# Altium schematic sheet Sheet1.SchDoc
size A4; SheetNumber: 1; SheetTotal: 1
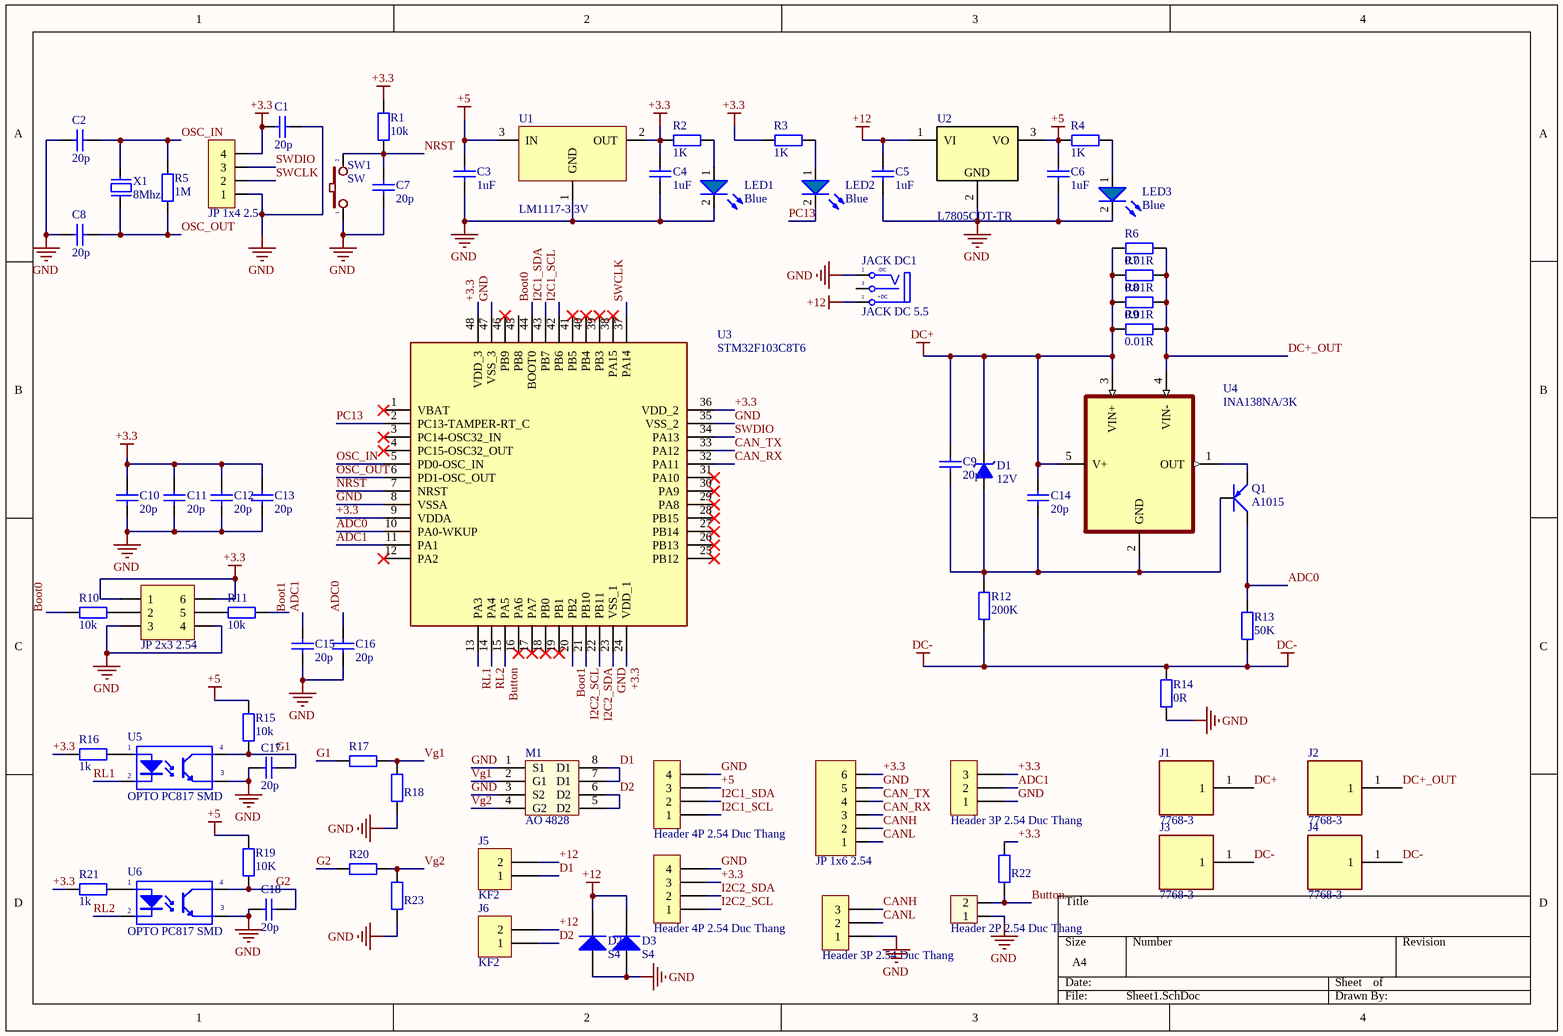
[diagram p0: Sheet1.SchDoc]

## Parts
C1  20p  [tu 0805]
C2  20p  [tu 0805]
C3  1uF  [tu 0805]
C4  1uF  [tu 0805]
C5  1uF  [tu 0805]
C6  1uF  [tu 0805]
C7  20p  [tu 0805]
C8  20p  [tu 0805]
C9  20p  [tu 0805]
C10  20p  [tu 0805]
C11  20p  [tu 0805]
C12  20p  [tu 0805]
C13  20p  [tu 0805]
C14  20p  [tu 0805]
C15  20p  [tu 0805]
C16  20p  [tu 0805]
C17  20p  [tu 0805]
C18  20p  [tu 0805]
D1  12V  [DIODE ZENNER SMD SOD80]
D2  S4  [DIODE SOD-123]
D3  S4  [DIODE SOD-123]
H1  Header 4P 2.54 Duc Thang  [XH2.54M-4]
H2  Header 3P 2.54 Duc Thang  [XH2.54M-3]
H3  Header 4P 2.54 Duc Thang  [XH2.54M-4]
H4  Header 3P 2.54 Duc Thang  [XH2.54M-3]
H5  Header 2P 2.54 Duc Thang  [XH2.54M-2]
J1  7768-3  [KEYSTONE_7768-3]
J2  7768-3  [KEYSTONE_7768-3]
J3  7768-3  [KEYSTONE_7768-3]
J4  7768-3  [KEYSTONE_7768-3]
J5  KF2  [KF2-5.08]
J6  KF2  [KF2-5.08]
JACK_DC1  JACK DC 5.5  [JACK DC 5.5]
JP1  JP 1x4 2.54  [JP 1x4 DT]
JP2  JP 2x3 2.54  [JP 2x3 DT]
JP3  JP 1x6 2.54  [JP 1x6 CT]
LED1  value Blue  [LED-0805-Blue]  (hidden comment: LED-Blue)
LED2  value Blue  [LED-0805-Blue]  (hidden comment: LED-Blue)
LED3  value Blue  [LED-0805-Blue]  (hidden comment: LED-Blue)
M1  AO 4828  [SOp 8]
Q1  A1015  [TO92]
R1  10k  [tro smd 0805]
R2  1K  [tro smd 0805]
R3  1K  [tro smd 0805]
R4  1K  [tro smd 0805]
R5  1M  [tro smd 0805]
R6  0.01R  [tro smd 2512]
R7  0.01R  [tro smd 2512]
R8  0.01R  [tro smd 2512]
R9  0.01R  [tro smd 2512]
R10  10k  [tro smd 0805]
R11  10k  [tro smd 0805]
R12  200K  [tro vach 1/4w]
R13  50K  [tro smd 0805]
R14  0R  [tro smd 0805]
R15  10k  [tro smd 0805]
R16  1k  [tro smd 0805]
R17  1k  [tro smd 0805]  (value not drawn)
R18  10k  [tro smd 0805]  (value not drawn)
R19  10K  [tro smd 0805]
R20  1k  [tro smd 0805]  (value not drawn)
R21  1k  [tro smd 0805]
R22  10k  [tro smd 0805]  (value not drawn)
R23  10k  [tro smd 0805]  (value not drawn)
SW1  SW  [SW1-SMD]
U1  LM1117-3.3V  [SOT223]
U2  L7805CDT-TR  [DPAK_118_446_112X59_SMD]
U3  STM32F103C8T6  [LQFP-48_19.6_393_58X11_SMD]
U4  INA138NA/3K  [SOT95P280X145-5N]
U5  OPTO PC817 SMD  [SOP4]
U6  OPTO PC817 SMD  [SOP4]
X1  8Mhz  [XT2]

## Nets
+3.3: C1.1 C4.1 C10.1 C11.1 C12.1 C13.1 H2.3 H3.3 JP1.4 JP2.1 JP2.6 JP3.6 R1.2 R2.2 R3.2 R16.1 R21.1 R22.2 U1.2(OUT) U3.9(VDDA) U3.24(VDD_1) U3.36(VDD_2) U3.48(VDD_3)
+5: C3.1 C6.1 H1.3 R4.2 R15.1 R19.1 U1.3(IN) U2.3(VO)
+12: C5.1 D2.2(K) D3.2(K) J5.2 J6.2 JACK_DC1.1(T) U2.1(VI)
DC+: C9.1 C14.1 D1.2(K) J1.1 R6.1 R7.1 R8.1 R9.1 U4.3(VIN+) U4.5(V+)
DC-: J3.1 J4.1 R12.1 R13.1 R14.2
GND: C1.2 C2.2 C3.2 C4.2 C5.2 C6.2 C7.2 C8.2 C10.2 C11.2 C12.2 C13.2 C15.2 C16.1 C17.1 C18.1 D2.1(A) D3.1(A) H1.4 H2.1 H3.4 H4.1 H5.1 JACK_DC1.2(TN) JP1.1 JP2.3 JP2.4 JP3.5 LED1.2(K) LED3.2(K) M1.1(S1) M1.3(S2) R14.1 R18.1 R23.1 SW1.1 U1.1(GND) U2.2 U3.8(VSSA) U3.23(VSS_1) U3.35(VSS_2) U3.47(VSS_3) U5.3(E) U6.3(E)
ADC0: C16.2 Q1.2(C) R13.2 U3.10(PA0-WKUP)
ADC1: C15.1 H2.2 U3.11(PA1)
Boot0: R10.1 U3.44(BOOT0)
Boot1: R11.2 U3.20(PB2)
Button: H5.2 R22.1 U3.15(PA5)
CAN_RX: JP3.3 U3.32(PA11)
CAN_TX: JP3.4 U3.33(PA12)
CANH: H4.3 JP3.2
CANL: H4.2 JP3.1
D1: J5.1 M1.7(D1) M1.8(D1)
D2: J6.1 M1.5(D2) M1.6(D2)
DC+_OUT: J2.1 R6.2 R7.2 R8.2 R9.2 U4.4(VIN-)
G1: C17.2 R15.2 R17.1 U5.4(C)
G2: C18.2 R19.2 R20.1 U6.4(C)
I2C1_SCL: H1.1 U3.42(PB6)
I2C1_SDA: H1.2 U3.43(PB7)
I2C2_SCL: H3.1 U3.21(PB10)
I2C2_SDA: H3.2 U3.22(PB11)
NRST: C7.1 R1.1 SW1.2 U3.7(NRST)
OSC_IN: C2.1 R5.1 U3.5(PD0-OSC_IN) X1.2
OSC_OUT: C8.1 R5.2 U3.6(PD1-OSC_OUT) X1.1
PC13: LED2.2(K) U3.2(PC13-TAMPER-RT_C)
RL1: U3.13(PA3) U5.2(K)
RL2: U3.14(PA4) U6.2(K)
SWCLK: JP1.2 U3.37(PA14)
SWDIO: JP1.3 U3.34(PA13)
Vg1: M1.2(G1) R17.2 R18.2
Vg2: M1.4(G2) R20.2 R23.2
NetC9_2: C9.2 C14.2 D1.1(A) Q1.3(B) R12.2 U4.2(GND)
NetJP2_2: JP2.2 R10.2
NetJP2_5: JP2.5 R11.1
NetLED1_1: LED1.1(A) R2.1
NetLED2_1: LED2.1(A) R3.1
NetLED3_1: LED3.1(A) R4.1
NetQ1_1: Q1.1(E) U4.1(OUT)
NetR16_2: R16.2 U5.1(A)
NetR21_2: R21.2 U6.1(A)

Not connected (* = marked no-connect by the designer): JACK_DC1 3(S); U3 1(VBAT)* 3(PC14-OSC32_IN)* 4(PC15-OSC32_OUT)* 12(PA2)* 16(PA6)* 17(PA7)* 18(PB0)* 19(PB1)* 25(PB12)* 26(PB13)* 27(PB14)* 28(PB15)* 29(PA8)* 30(PA9)* 31(PA10)* 38(PA15)* 39(PB3)* 40(PB4)* 41(PB5)* 45(PB8) 46(PB9)*

## Notes on the sheet
- (in symbol JACK DC 5.5) -DC; +DC
- (in symbol REG_35V_5V-1.5A-7.5W-DPAK) GND

## Library data of the parts
C1-C18 = Tu 0805 474 50V 10%: Dán; Don_Vi: Con; So_Chan: 2; Ten_Linh_Kien: Tụ 0805 474-470nF 50V 10%; Ma_Hang: MH006116; Chung_Loai: Dán; Kieu_Chan: *
D1 = Diode Zener 12V: Dán; Ma_Hang: MH000945; Don_Vi: Con; Ten_Linh_Kien: Diode Zener 1/2W 12V SMD1206 ZMM12; Kieu_Chan: *; Ghi_Chu: *; Chung_Loai: Dán
D2 D3 = Diode S4: Dán; Ten_Linh_Kien: Diode S4 SOD123 ( 1N5819 SOD123); Ma_Hang: MH005519; Don_Vi: Con; Ghi_Chu: *; Chung_Loai: Dán; Kieu_Chan: *
H1 H3 = Header 4P 2.54 Duc Thang: Cắm; Ten_Linh_Kien: Header 4P XH2.54-4P Đực Thẳng; Don_Vi: Con; Ma_Hang: MH001285; Chung_Loai: Cắm
H2 H4 = Header 3P 2.54 Duc Thang: Cắm; Ten_Linh_Kien: Header 3P XH2.54-3P Đực Thẳng; Don_Vi: Con; Ma_Hang: MH001292; Chung_Loai: Cắm
H5 = Header 2P 2.54 Duc Thang: Cắm; Ten_Linh_Kien: Header 2P XH2.54-2P Đực Thẳng; Don_Vi: Con; Ma_Hang: MH001283; Chung_Loai: Cắm
J5 J6 = KF2: Manufacturer: Würth Elektronik eiSos GmbH; partNo: 691103110002; ComponentLink1 Description: Manufacturer; ComponentLink2 Description: Datasheet; NoPins: 2; Created Date: 29 October 2013; ComponentLink1URL: http://www.we-online.com; ComponentLink2URL: http://katalog.we-online.de/em/datasheet/6911031100xx.pdf; Created by: Karrer Zheng
JACK_DC1 = JACK DC 5.5: Value: Jac DC
JP1 = JP 1x4 2.54 Duc Thang: Cắm; Ten_Linh_Kien: Jump Đơn Đực 2.54MM 1x40P Thẳng 11MM; Don_Vi: Con; Ma_Hang: MH000903; Ghi_Chu: *; Kieu_Chan: *; Chung_Loai: Cắm
JP2 = JP 2x3 2.54 Duc Thang: Cắm; Ten_Linh_Kien: Jump Đôi Đực 2.54MM 2x40P Thẳng 11MM; Don_Vi: Con; Ma_Hang: MH002686; Ghi_Chu: *; Kieu_Chan: *; Chung_Loai: Cắm
JP3 = JP 1x6 2.54 Cai Thang: Cắm; Ten_Linh_Kien: Jump Đơn Cái 2.54MM 1x20P Thẳng; Don_Vi: Con; Ma_Hang: MH004006; Ghi_Chu: *; Kieu_Chan: *; Chung_Loai: Cắm
LED1-LED3 = LED-Blue: LED Blue 10mA 2.2v; ComponentLink1Description: Datasheet; ComponentLink1URL: D:\Dropbox\Datasheets\Opto and Illumination\LEDs\SMD LED.pdf; Unit Price: 0.0476
M1 = APM 4828 SMD: Dán; Ten_Linh_Kien: AO4828 SOP8 MOSFET N-2CH 4.5A 60V; Ma_Hang: MH005678; Don_Vi: Con; Kieu_Chan: *; Ghi_Chu: *; Chung_Loai: Dán
Q1 = A1015: PNP 600mW, ECB; Value: A1015
R1-R5 R10 R11 R13-R23 = Tro 0805 1% 33k: Dán; Don_Vi: Con; So_Chan: 2; Ten_Linh_Kien: Trở 0805 1% 33k; Ma_Hang: MH005478; Chung_Loai: Dán; Kieu_Chan: *
R6-R9 = Tro 2512 1% 0.01R: Dán; Don_Vi: Con; So_Chan: 2; Ten_Linh_Kien: Trở 2512 1% R010-0.01R 1W; Ma_Hang: MH004912; Chung_Loai: Dán; Kieu_Chan: *
R12 = Tro Vach 1/4W 5% 1.2M: Cắm; Don_Vi: Con; So_Chan: 2; Ten_Linh_Kien: Trở Vạch 1/4w 5% 1.2M; Ma_Hang: MH007349; Chung_Loai: Cắm; Kieu_Chan: *
SW1 = SW2: Switch button 2 pin; Value: SW chip 2 pin
U1 = LM1117: 800mA Low-Dropout Linear Regulator; Creator: Nguyen Ba Bien; Website: http://group3i.net
U2 = REG_35V_5V-1.5A-7.5W-DPAK: Linear Voltage Regulator IC 1 Output 1.5A DPAK; Manufacturer: Diodes; Alternate Part Number-1: CJ7805 3%; Manufacturer Part Number: L7805CDT-TR; Case/Package: DPAK; Supplier-1: SP ROAD; Supplier Part Number-1: L7805CDT-TR
U3 = IC_STM32F103C8T6: ARM® Cortex®-M3 STM32F1 Microcontroller IC 32-Bit 72MHz 64KB (64K x 8) FLASH 48-LQFP (7x7); Manufacturer: STMicroelectronics; Alternate Part Number-1: NA; Manufacturer Part Number: STM32F103C8T6; Case/Package: LQFP48; Supplier-1: LCSC; Supplier Part Number-1: STM32F103C8T6
U4 = INA138NA/3K: 2.7 to 36V, 800kHz Variable gain current sense amplifier 5-SOT-23 -40 to 125; MF: Texas Instruments; Package: SOT-23-5 Texas Instruments; DigiKey-Purchase-URL: https://snapeda.com/shop?store=DigiKey&id=11314; MP: INA138NA/3K; Mouser-Purchase-URL: https://snapeda.com/shop?store=Mouser&id=11314; Availability: Good; Price: None; Arrow_Electronics-Purchase-URL: https://snapeda.com/shop?store=Arrow+Electronics&id=11314; Texas_Instruments-Purchase-URL: https://snapeda.com/shop?store=Texas+Instruments&id=11314; Value: *; SnapEDA_Link: https://www.snapeda.com/parts/INA138NA/3K/Texas%20Instruments/view-part/11314/?ref=snap
U5 U6 = OPTO PC817 SMD: Single Opto; Value: PC817
X1 = XT2: Crystal, 32.768 KHz, -40 to 85 degC, 3.2 x 1.5 x 0.9 mm SMD; Value: 4Mhz
J1-J4 = 7768-3: Value: *; MP: 7768-3; Price: None; Availability: Unavailable; Package: None